# EAGLE design UV Sterlizer 2 (EAGLE 9.6.1)
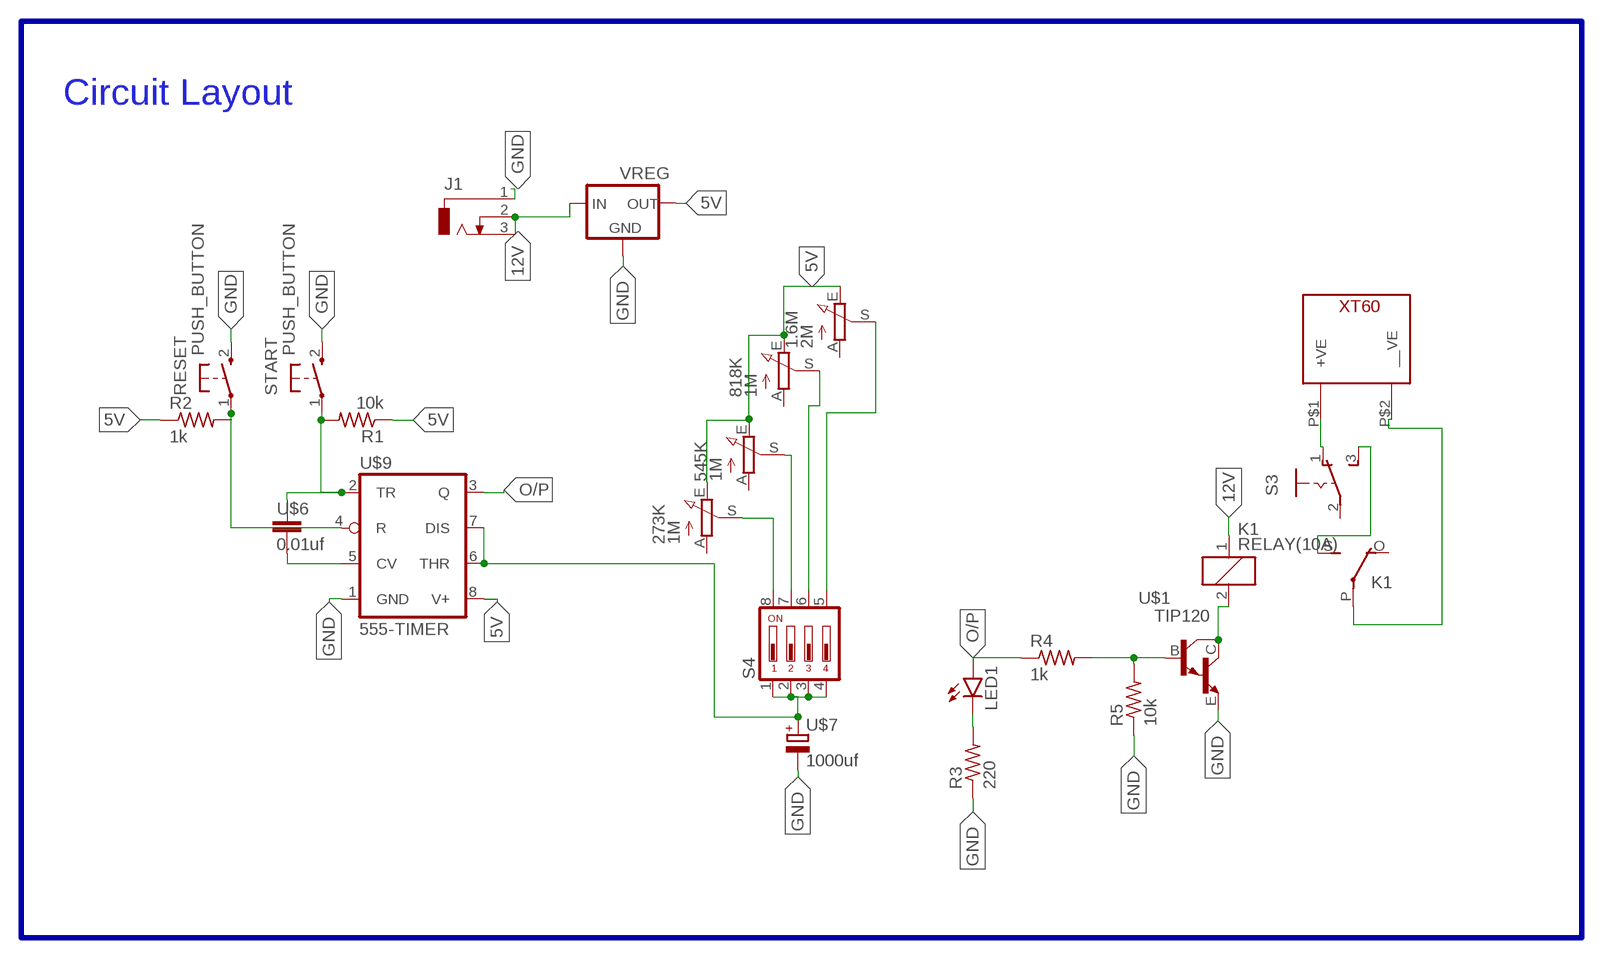
[diagram p0: schematic, sheet 1]

## Parts
1.6M  2M  TRIMMER  [RJ9W]
273K  1M  TRIMMER  [RJ9W]
545K  1M  TRIMMER  [RJ9W]
818K  1M  TRIMMER  [RJ9W]
J1  DCJ0303  [DCJ0303]
K1  RELAY(10A)  [G5LE]
LED1  LED5MM  [LED5MM]
R1  10k  R-US_0204/7  [0204/7]
R2  1k  R-US_0204/7  [0204/7]
R3  220  R-US_0204/7  [0204/7]
R4  1k  R-US_0204/7  [0204/7]
R5  10k  R-US_0204/7  [0204/7]
RESET  PUSH_BUTTON  [B3F-10XX]
S3  SLIDING_SWITCH  [255SB]
S4  DS04  [DS-04]
START  PUSH_BUTTON  [B3F-10XX]
U$1  TIP120  [TIP120]
U$6  0.01uf  CAPACITOR  [C025-025X050]
U$7  1000uf  CAP_POL  [E3,5-8]
U$8  XT60_CONNECTOR  [XT60]
U$9  555-TIMER  [DIL08]
VREG  78XX-METAL  [TO3-79]

## Nets
5V: 1.6M.E 273K.E 545K.E 818K.E R1.1 R2.1 U$9.8(V+) VREG.1(OUT)
12V: J1.2 J1.3 K1.1 VREG.3(IN)
GND: J1.1 R3.1 R5.1 RESET.2(S) START.2(S) U$1.E U$7.- U$9.1(GND) VREG.2(GND)
N$1: K1.2 U$1.C
N$2: R4.2 R5.2 U$1.B
N$3: K1.S(2:S) S3.3(S)
N$4: K1.P(2:P) U$8.P$2(__VE)
N$6: R1.2 START.1(P) U$6.1 U$9.2(TR)
N$7: LED1.K(C) R3.2
N$8: 273K.S S4.8
N$9: 545K.S S4.7
N$10: 818K.S S4.6
N$11: 1.6M.S S4.5
N$12: S3.1(O) U$8.P$1(+VE)
N$13: S4.1 S4.2 S4.3 S4.4 U$7.+ U$9.6(THR) U$9.7(DIS)
N$14: U$6.2 U$9.5(CV)
N$16: R2.2 RESET.1(P) U$9.4(R)
O/P: LED1.A R4.1 U$9.3(Q)
Unconnected: 1.6M.A 273K.A 545K.A 818K.A K1.O(2:O) S3.2(P)

## Buses
5V

## Notes on the sheet
- Circuit Layout

## Library data of the parts
1.6M 273K 545K 818K = MIA_LIBRARY-2-2-2:TRIMMER
J1 = con-jack:DCJ0303: DC POWER JACK Source: DCJ0303.pdf; OC_FARNELL: unknown; OC_NEWARK: unknown
K1 = MIA_LIBRARY-2-2-2:RELAY(10A): RELAY 1 x switch, 10 A/120 V AC, 8 A/30 V ADC, Omron; OC_FARNELL: unknown; OC_NEWARK: unknown
LED1 = led:LED: LED OSRAM: - CHIPLED LG R971, LG N971, LY N971, LG Q971, LY Q971, LO R971, LY R971 LH N974, LH R974 LS Q976, LO Q976, LY Q976 LO Q996 - Hyper CHIPLED LW Q18S LB Q993, LB Q99A, LB R99A - SideLED LS A670, LO A670, LY A670, LG A670, LP A670 LB A673, LV A673, LT A673, LW A673 LH A674 LY A675 LS A676, LA A676, LO A676, LY A676, LW A676 LS A679, LY A679, LG A679 - Hyper Micro SIDELED® LS Y876, LA Y876, LO Y876, LY Y876 LT Y87S - SmartLED LW L88C, LW L88S LB L89C, LB L89S, LG L890 LS L89K, LO L89K, LY L89K LS L896, LA L896, LO L896, LY L896 - TOPLED LS T670, LO T670, LY T670, LG T670, LP T670 LSG T670, LSP T670, LSY T670, LOP T670, LYG T670 LG T671, LOG T671, LSG T671 LB T673, LV T673, LT T673, LW T673 LH T674 LS T676, LA T676, LO T676, LY T676, LB T676, LH T676, LSB T676, LW T676 LB T67C, LV T67C, LT T67C, LS T67K, LO T67K, LY T67K, LW E67C LS E67B, LA E67B, LO E67B, LY E67B, LB E67C, LV E67C, LT E67C LW T67C LS T679, LY T679, LG T679 LS T770, LO T770, LY T770, LG T770, LP T770 LB T773, LV T773, LT T773, LW T773 LH T774 LS E675, LA E675, LY E675, LS T675 LS T776, LA T776, LO T776, LY T776, LB T776 LHGB T686 LT T68C, LB T68C - Hyper Mini TOPLED® LB M676 - Mini TOPLED Santana® LG M470 LS M47K, LO M47K, LY M47K Source: http://www.osram.convergy.de LUXEON: - LUMILED® LXK2-PW12-R00, LXK2-PW12-S00, LXK2-PW14-U00, LXK2-PW14-V00 LXK2-PM12-R00, LXK2-PM12-S00, LXK2-PM14-U00 LXK2-PE12-Q00, LXK2-PE12-R00, LXK2-PE12-S00, LXK2-PE14-T00, LXK2-PE14-U00 LXK2-PB12-K00, LXK2-PB12-L00, LXK2-PB12-M00, LXK2-PB14-N00, LXK2-PB14-P00, LXK2-PB14-Q00 LXK2-PR12-L00, LXK2-PR12-M00, LXK2-PR14-Q00, LXK2-PR14-R00 LXK2-PD12-Q00, LXK2-PD12-R00, LXK2-PD12-S00 LXK2-PH12-R00, LXK2-PH12-S00 LXK2-PL12-P00, LXK2-PL12-Q00, LXK2-PL12-R00 Source: www.luxeon.com KINGBRIGHT: KA-3528ASYC Source: www.kingbright.com
R1-R5 = rcl:R-US_: RESISTOR, American symbol; SPICEPREFIX: R
RESET START = MIA_LIBRARY-2-2-2:PUSH_BUTTON: OMRON SWITCH
S3 = MIA_LIBRARY-2-2-2:SLIDING_SWITCH: SLIDING SWITCH Distributor Buerklin, 11G810
S4 = switch-dil:DS04: DIL/CODE SWITCH; OC_FARNELL: 9471570; OC_NEWARK: unknown
U$1 = MIA_LIBRARY-2-2-2:TIP120: pinhead
U$6 = MIA_LIBRARY-2-2-2:CAPACITOR
U$7 = MIA_LIBRARY-2-2-2:CAP_POL
U$8 = MIA_LIBRARY-2-2-2:XT60_CONNECTOR
U$9 = MIA_LIBRARY-2-2-2:555-TIMER
VREG = MIA_LIBRARY-2-2-2:78XX-METAL: VOLTAGE REGULATOR

## Board
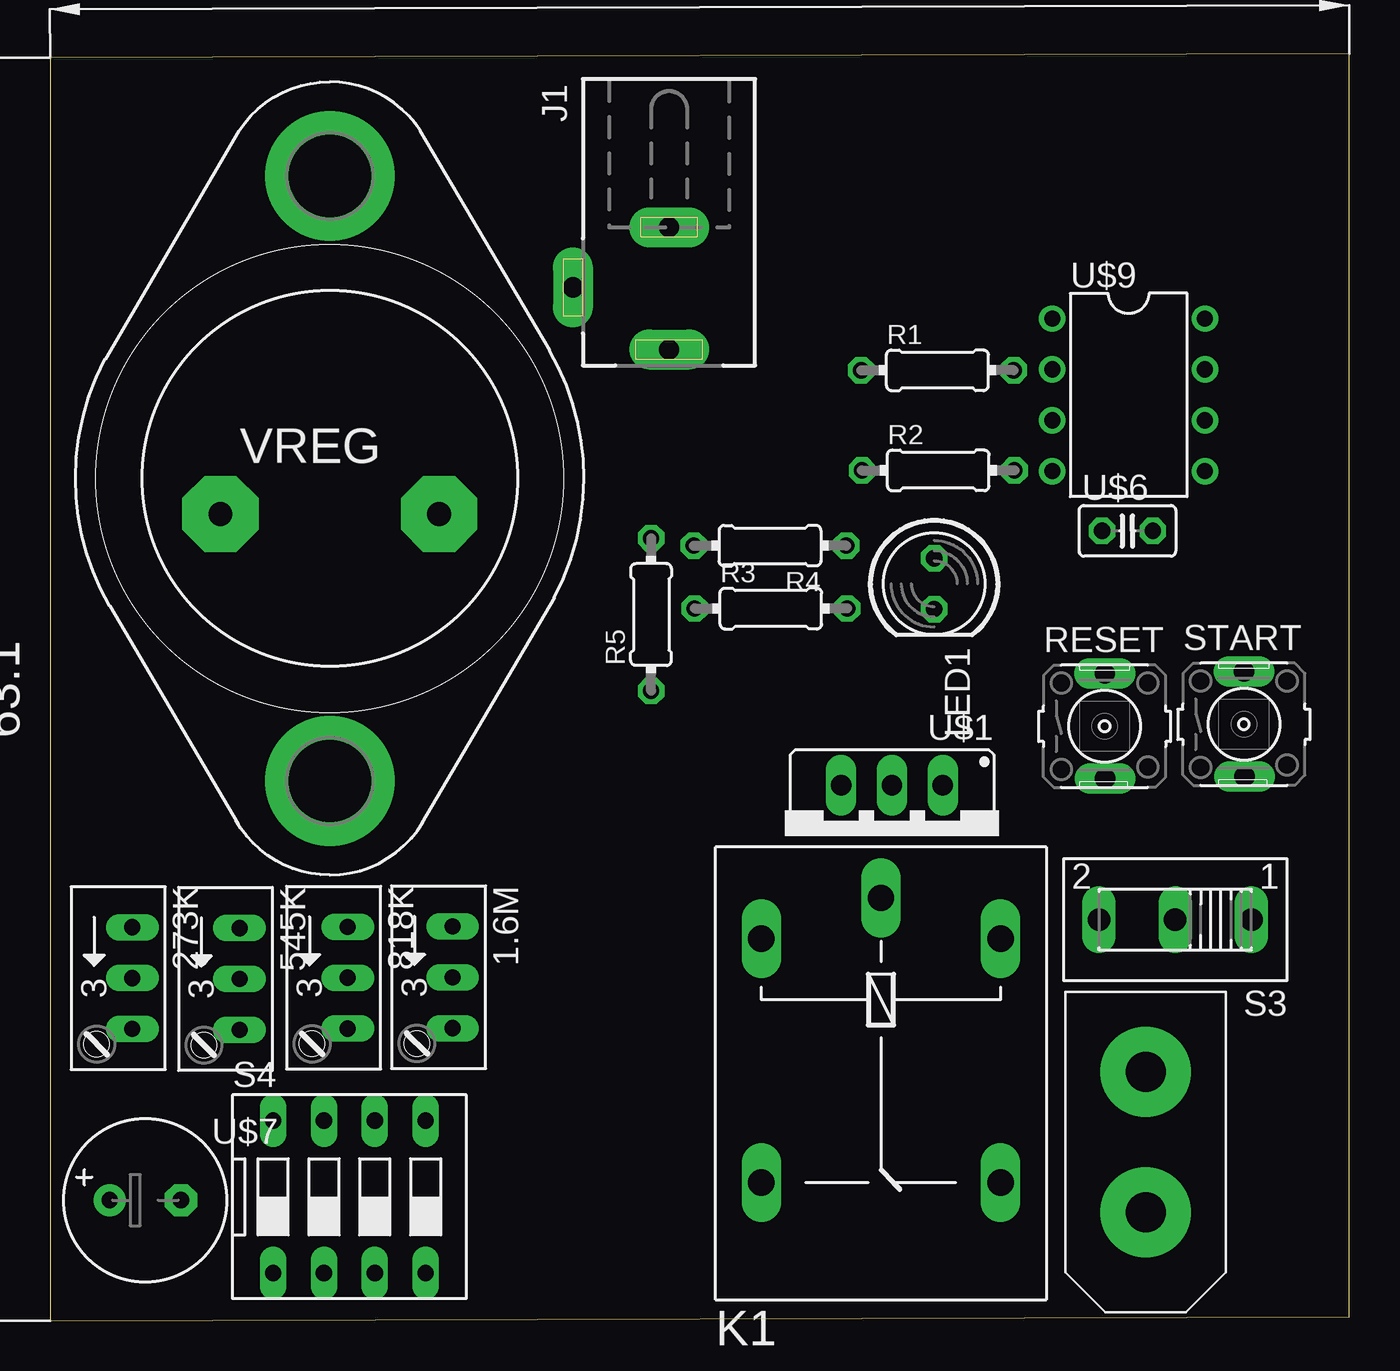
[diagram p1: board, top side]
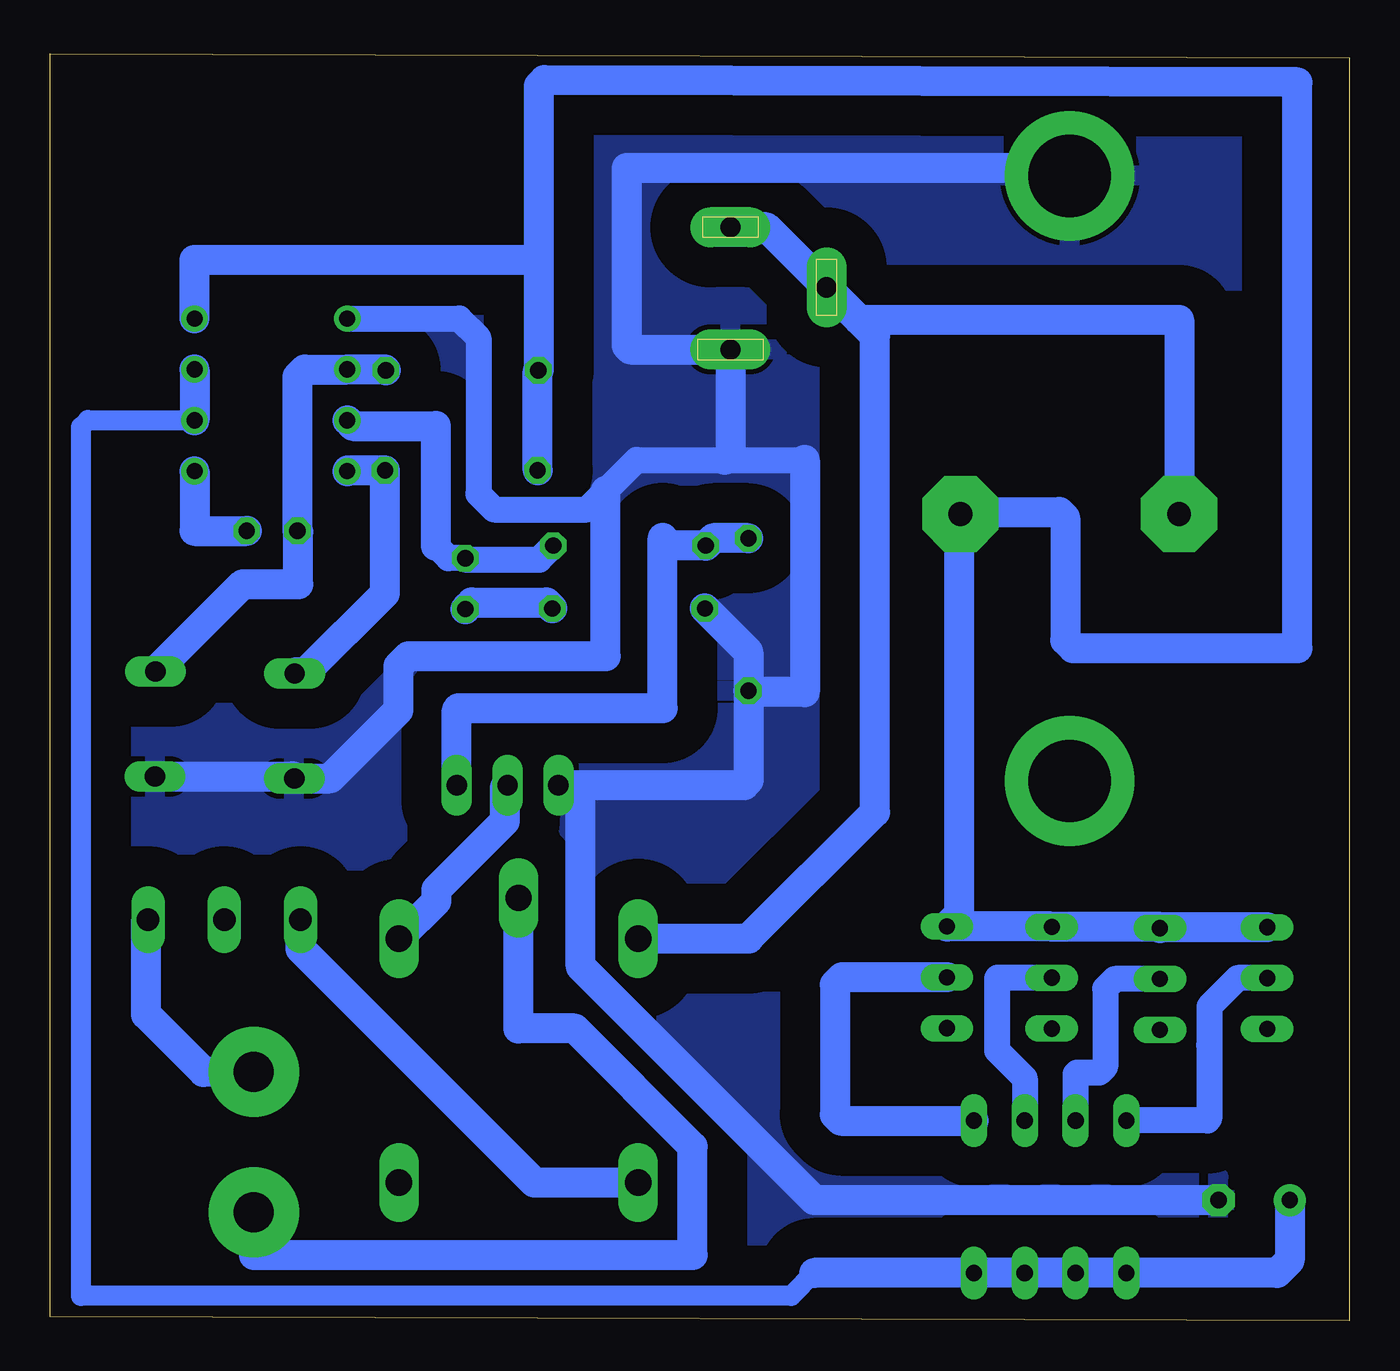
[diagram p2: board, bottom side, seen from below]

Size 64.9 x 63.3 mm. Coordinates in mm from the lower left corner, seen from the top.
Outline: 0,0 64.9,0.2 64.9,63.3 0,63.1 0,0
Copper layers (1*16): Top 0.035mm / dielectric 1.5mm / Bottom 0.035mm
Design rules "default *": minimum track width 0.8mm, minimum drill 0.35mm, track to track 0.5mm, track to pad 0.5mm, pad to pad 6mil, via to via 6mil, smd to smd 6mil, copper to edge 0.5mm, drill to drill 6mil, minimum pad ring 10mil, minimum via ring 8mil, stop-mask expansion 4mil, vias tented up to drill 0mil, thermal gap 10mil

### Footprints (pad centres in the part's own frame; a part is rotated, then mirrored left to right if it is on the bottom)
RJ9W = drill 0.813 long: A 2.54,0.635; E -2.54,0.635; S 0,0.635
DCJ0303 = drill 1 pad 2 long: 1 0,3.1; 2 4.8,0; 3 0,-3
G5LE = drill 1.321 long: 1 -7.493,-5.969; 2 -7.493,5.969; O 4.699,5.969; P -9.525,0; S 4.699,-5.969
LED5MM = drill 0.813 octagon: A -1.27,0; K 1.27,0
0204/7 = drill 0.813 octagon: 1 -3.81,0; 2 3.81,0
B3F-10XX = drill 1.016 long: 1 0.013,2.636; 2 0.029,-2.605
255SB = drill 1.118 long: 1 -3.81,0; 2 0,0; 3 3.81,0
DS-04 = drill 0.813 long: 1 -3.81,-3.81; 2 -1.27,-3.81; 3 1.27,-3.81; 4 3.81,-3.81; 5 3.81,3.81; 6 1.27,3.81; 7 -1.27,3.81; 8 -3.81,3.81
TIP120 = drill 1.016 long: B -2.54,-2.54; C 0,-2.54; E 2.54,-2.54
C025-025X050 = drill 0.813 octagon: 1 -1.27,0; 2 1.27,0
E3,5-8 = drill 0.813 pad 1.6: + -1.778,0 | drill 0.813 pad 1.6 octagon: - 1.778,0
XT60 = drill 2 pad 4.5: P$1 -4,-4; P$2 -11,-4
DIL08 = drill 0.813 pad 1.27: 1 -3.81,-3.81; 2 -1.27,-3.81; 3 1.27,-3.81; 4 3.81,-3.81; 5 3.81,3.81; 6 1.27,3.81; 7 -1.27,3.81; 8 -3.81,3.81
TO3-79 = drill 1.194 pad 3.81 octagon: 1 -1.778,-5.461; 3 -1.778,5.461 | drill 4.115 pad 6.477: 2 15.113,0; 3@ -15.113,0

### Placement (x,y rotation side)
1.6M  19.47,17.16 270 top
273K  3.47,17.12 270 top
545K  8.83,17.08 270 top
818K  14.23,17.14 270 top
J1  30.92,51.62 180 top
K1  41.5,11.6 270 top
LED1  44.16,36.82 270 top
R1  44.32,47.48 0 top
R2  44.36,42.48 0 top
R3  36,35.58 0 top
R4  35.96,38.72 180 top
R5  30.02,35.28 90 top
RESET  52.67,29.7 0 top
S3  56.2,20.04 180 top
S4  14.95,6.2 0 top
START  59.63,29.8 0 top
U$1  42.05,24.22 180 top
U$6  53.81,39.46 0 top
U$7  4.76,6.03 0 top
U$8  50.72,16.43 90 top
U$9  53.87,46.25 270 top
VREG  13.97,42.08 90 top

### Tracks (layer width: path | path; a pad name or v marks a point on that pad's centre or on a via)
5V
  Bottom 1.5: U$9.8 57.68,53 40.9,53 40.5,52.6 | 40.5,52.6 R1.1 40.55,47.44 R2.1 | 273K.E 9.43,19.66 545K.E 9.53,19.68 818K.E 14.88,19.7 1.6M.E 19.5,20.3 19.5,40.23 VREG.1 19.33,40.4 14.5,40.4 14.2,40.1 14.2,34 13.8,33.6 2.6,33.6 2.6,61.86 40.2,61.97 40.5,61.68 40.5,52.6
12V
  Bottom 1.5: J1.2 29.12,54.62 J1.3 | J1.2 24.5,50 8.5,50 VREG.3 | K1.1 30.01,19.09 23.7,25.4 23.7,49.2 J1.2
GND
  Bottom 1.3: U$9.1 44.46,50.06 43.5,49.1 43.5,41.3 42.73,40.53 38.07,40.53 37.15,41.45 35.6,43 31.2,43 27.2,43
  Bottom 1.5: R3.1 30.02,33.41 R5.1 30,31.45 | START.2 52.8,27.2 RESET.2 50.91,27.09 47.5,30.5 47.5,32.7 47,33.2 37.15,33.2 37.15,41.45 | U$1.E 38.3,26.76 | 38.3,26.76 30.24,26.76 30,27 30,31.45 | 27.2,43 27.2,31.4 29.95,31.4 30,31.45 | J1.1 30.92,43.28 31.2,43 | 30.94,48.5 J1.1 | 38.3,26.76 38.4,26.66 38.4,17.7 26.73,6.03 U$7.- | VREG.2 14.37,57.59 36.1,57.59 36.1,48.7 35.92,48.52 J1.1
  pour Bottom (isolate 2): 72,71.9 73.3,70.6 73.3,-2.9 73.6,-3.2 -5.2,-3.2 -7.8,-0.6 -8.9,0.5 -8.9,71.8 -8.8,71.9 -5.3,71.9
N$1
  Bottom 1.5: K1.2 45.6,20.96 45.6,21.54 42.18,24.96 42.18,26.63 U$1.C
N$2
  Bottom 1.5: U$1.B 44.59,30.51 44.5,30.6 34.3,30.6 34.3,39.1 33.92,38.72 R4.2 31.78,39.09 R5.2
N$3
  Bottom 1.5: K1.S 40.7,6.9 52.39,18.59 S3.3
N$4
  Bottom 1.5: U$8.P$2 54.72,3.3 32.8,3.3 32.8,8.7 38.7,14.6 41.5,14.6 K1.P
N$6
  Bottom 1.5: R1.2 48.17,47.52 U$9.2 52.18,47.52 52.54,47.16 U$6.1 52.5,39.42 52.5,36.8 55.28,36.8 START.1
N$7
  Bottom 1.5: R3.2 40.11,35.88 43.83,35.88 LED1.K
N$8
  Bottom 1.3: 273K.S 5.58,17.12 6.99,15.71 6.99,13.79 7,13.78 7,10.1 7.09,10.01 S4.8
N$9
  Bottom 1.3: 545K.S 11.72,17.08 12.2,16.6 12.2,12.7 12.5,12.4 13.6,12.4 13.68,12.32 S4.7
N$10
  Bottom 1.3: 818K.S 17.56,17.14 17.6,17.1 17.6,13.5 16.22,12.12 S4.6
N$11
  Bottom 1.5: 1.6M.S 25.34,17.16 25.7,16.8 25.7,10.3 25.4,10 S4.5
N$12
  Bottom 1.5: U$8.P$1 57.23,12.43 60.1,15.3 60.1,19.95 S3.1
N$13
  Bottom 1: 26.73,2.39 27.88,1.25 63.35,1.25 63.35,44.65 63,45 57.7,45 U$9.6
  Bottom 1.5: U$9.7 U$9.6 | U$7.+ 2.98,3.02 3.61,2.39 S4.1 S4.2 S4.3 S4.4 26.73,2.39
N$14
  Bottom 1.5: U$9.5 57.68,39.46 U$6.2
N$16
  Bottom 1.5: U$9.4 50.02,42.48 R2.2 48.17,36.33 52.1,32.4 52.62,32.4 RESET.1
O/P
  Bottom 1.3: R4.1 40.47,38.02 44.09,38.02 LED1.A 45,38.09 45.63,38.72
  Bottom 1.5: U$9.3 49.78,44.7 45.63,44.7 45.63,38.72